# Altium project BugBuster_DAQ.PrjPcb (part 3 of 3)
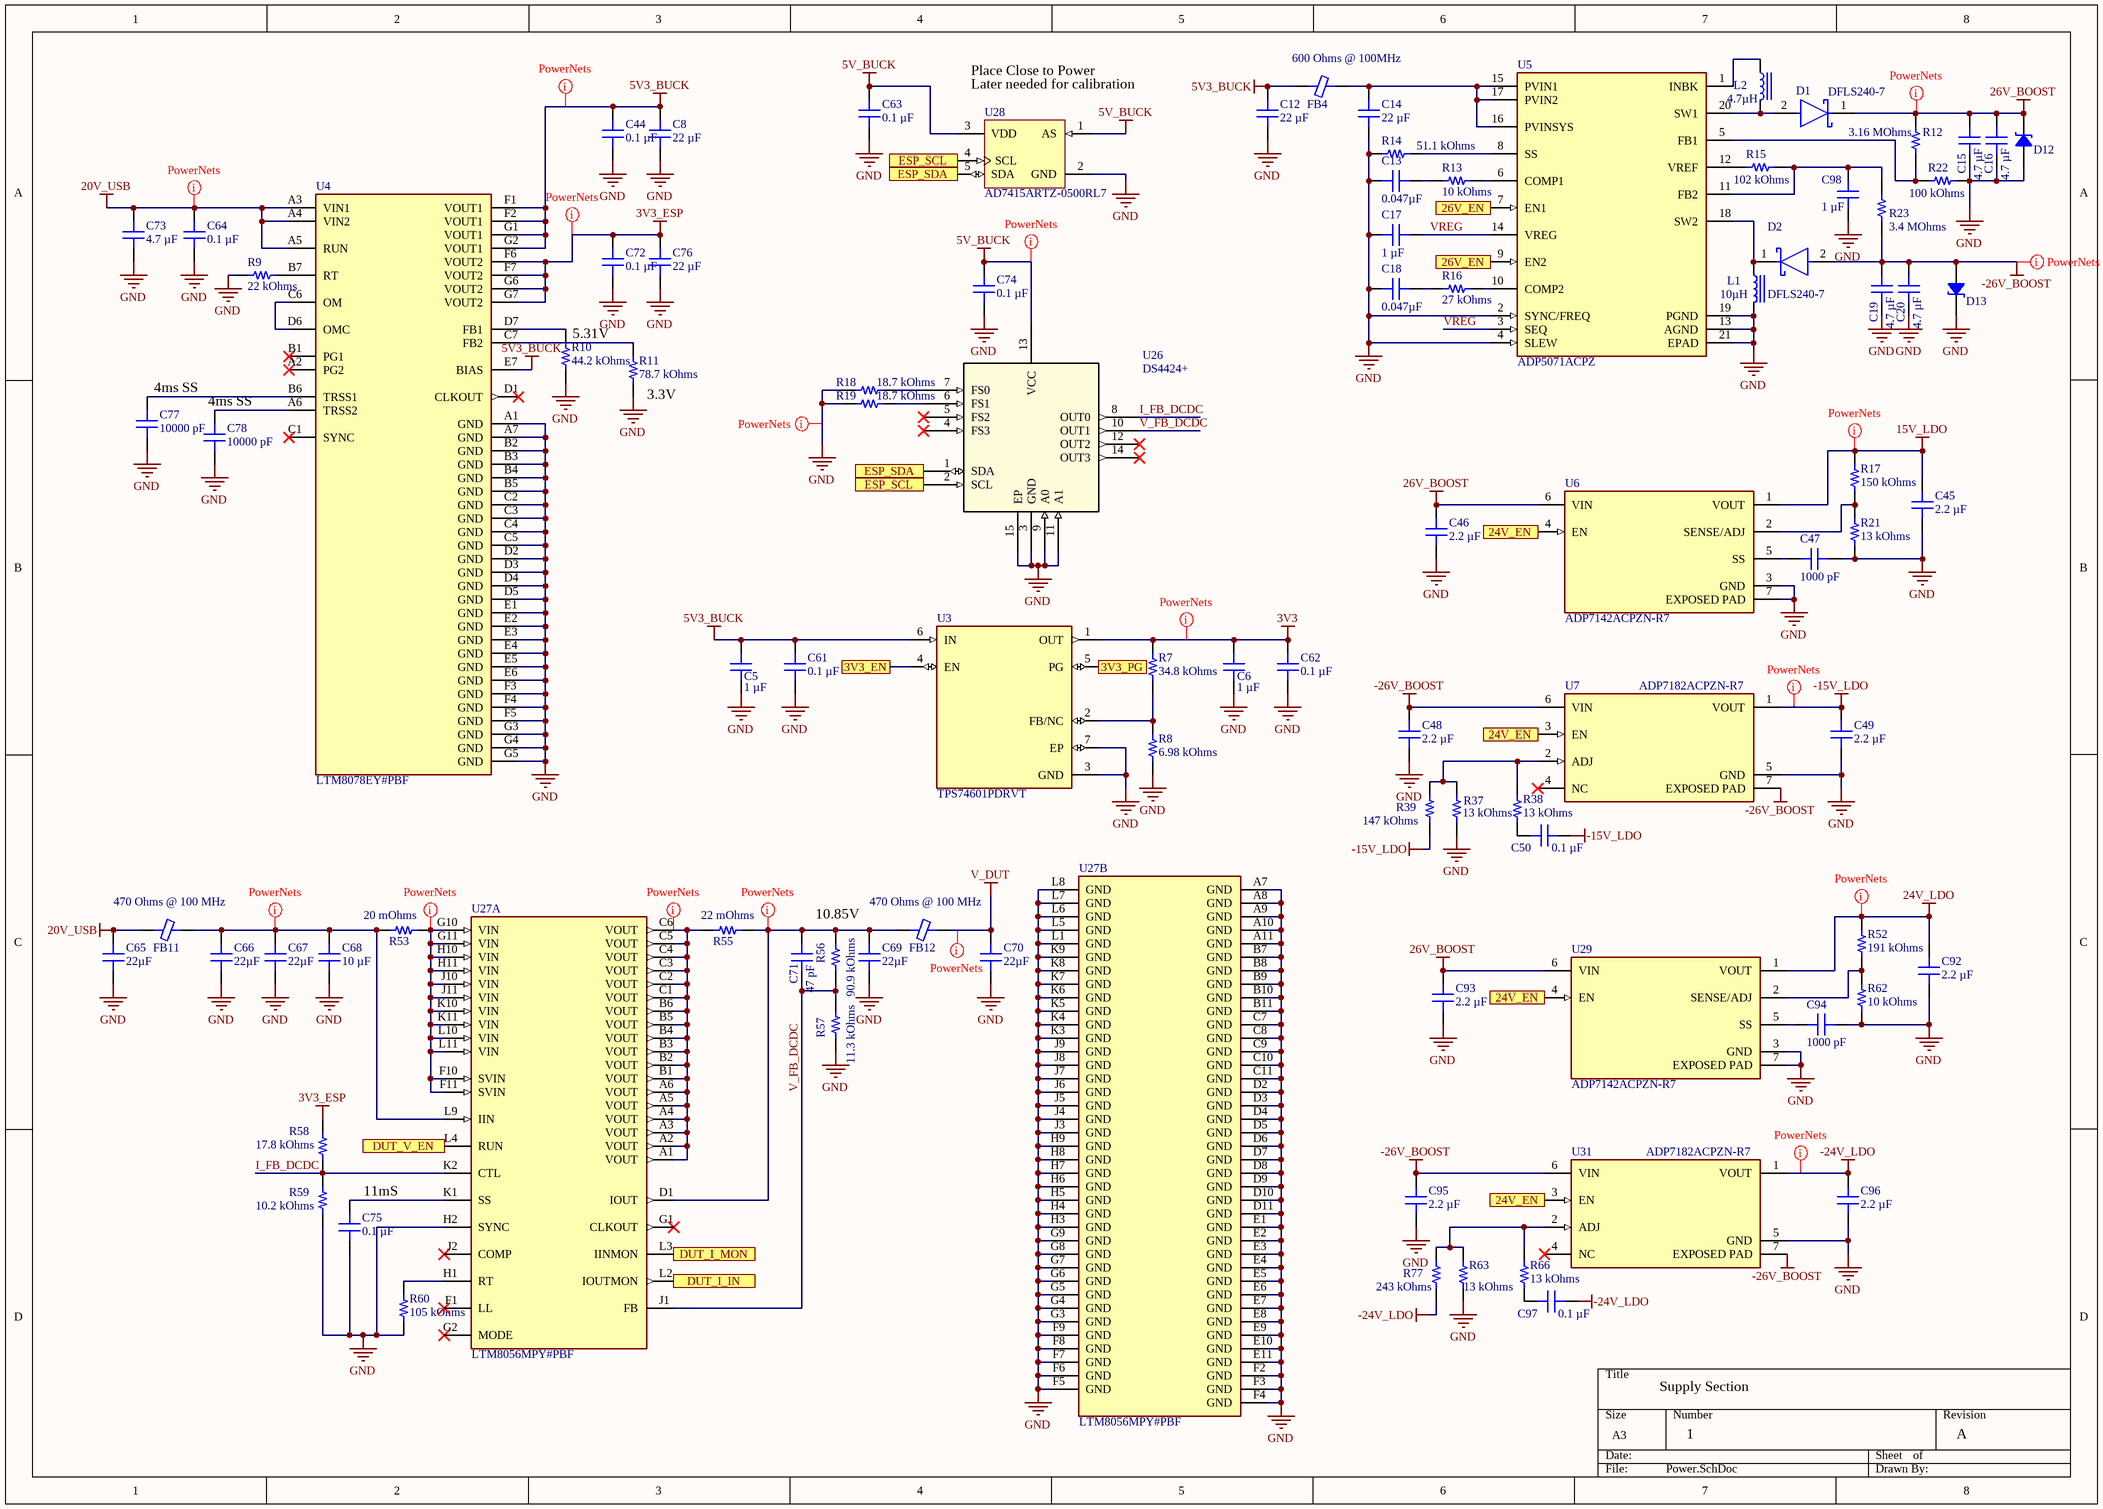
[diagram p7: Power.SchDoc]

## Sheet Power.SchDoc (continued)

### Library data of the parts (continued)
U28 = AD7415ARTZ-0500RL7: +/-0.5 degrees C Accurate, 10-Bit Digital Temperature Sensor, 2.7 to 5.5 V Supply, Industrial, 5-pin SOT23 (RJ-5), Reel; Manufacturer: Analog Devices; Code_JEDEC: MO-178-AA; ComponentLink3URL: http://www.analog.com/static/imported-files/packages/PKG_PDF/SOT-23(RJ)/RJ_5.pdf; ComponentLink3Description: Package Specification; PartNumber: AD7415ARTZ-0500RL7; PackageDescription: 5-Pin Small Outline Transistor Package, Body 2.9 x 1.6 mm, Pitch 0.95 mm; Supply Voltage Range: 2.7 to 5.5 V; Packing: Reel; DatasheetVersion: Rev. F; Mounting Technology: Surface Mount; PackageVersion: 121608-A , 12/2008; ComponentLink1URL: http://www.analog.com/en/index.html; PackageReference: RJ-5; ComponentLink4Description: Product URL; ComponentLink4URL: http://www.analog.com/en/mems-sensors/digital-temperature-sensors/ad7415/products/product.html; ComponentLink2Description: Datasheet; ComponentLink2URL: http://www.analog.com/static/imported-files/data_sheets/AD7414_7415.pdf; ComponentLink1Description: Manufacturer URL

## Sheet IOs.SchDoc
size A4; SheetNumber: 3; SheetTotal: 5
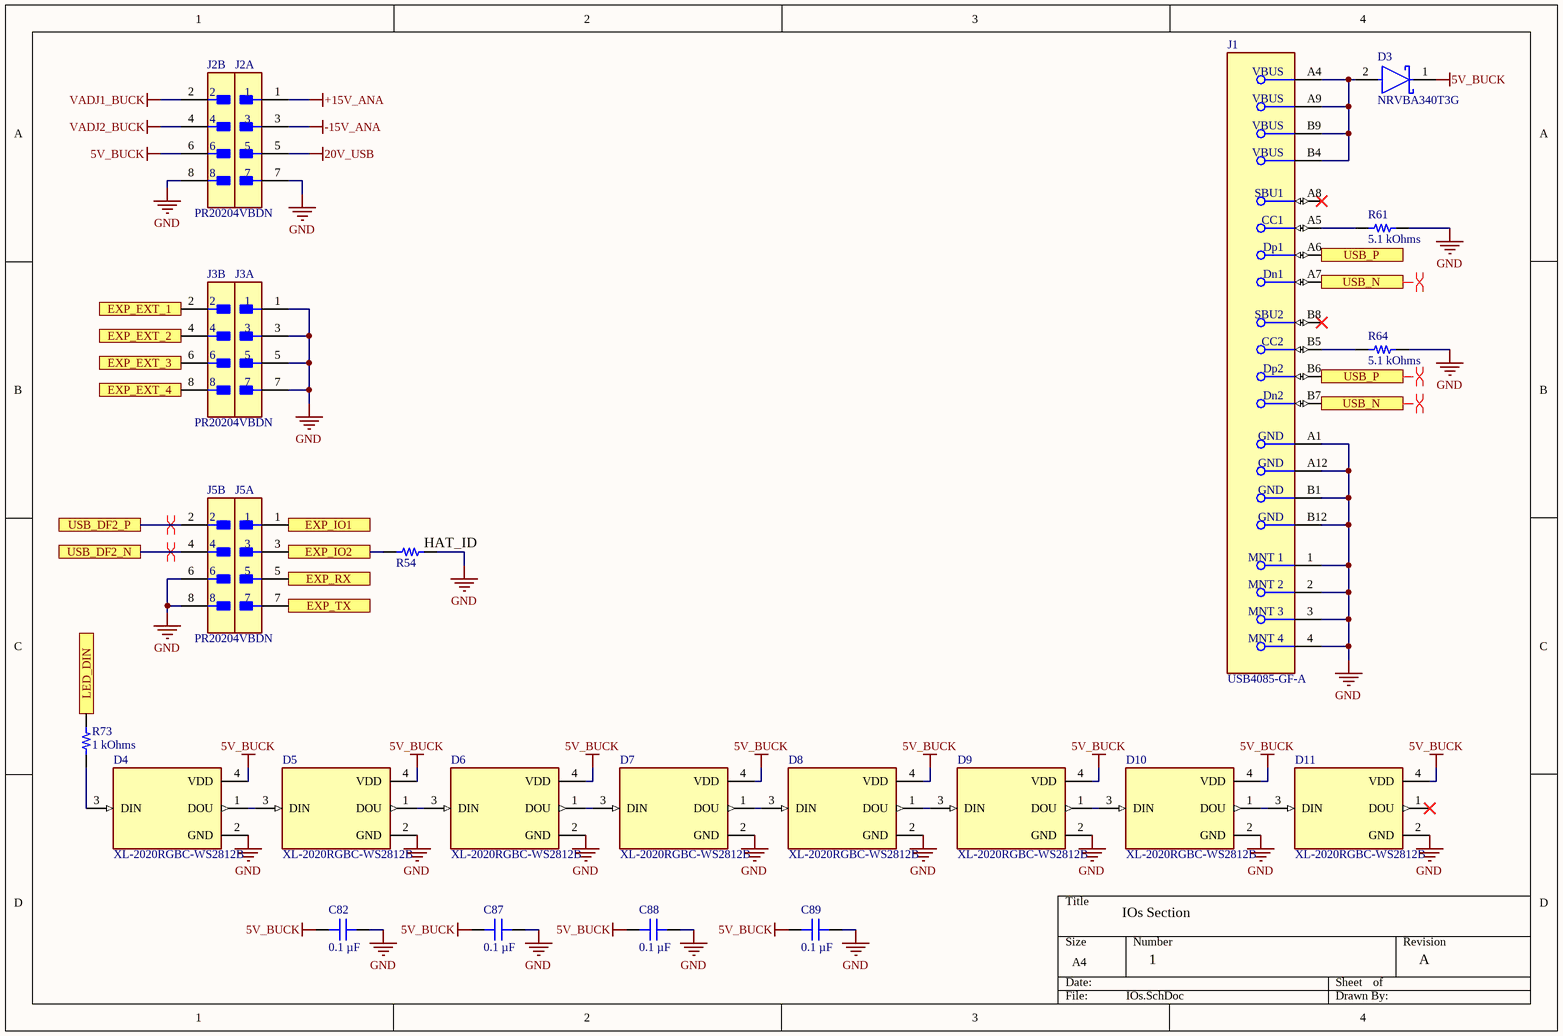
[diagram p3: IOs.SchDoc]

### Parts
C82  0.1 µF  [CAP 0603_1608]
C87  0.1 µF  [CAP 0603_1608]
C88  0.1 µF  [CAP 0603_1608]
C89  0.1 µF  [CAP 0603_1608]
D3  NRVBA340T3G  [FP-403D-MFG]
D4  XL-2020RGBC-WS2812B  [LED_XL-2020RGBC-WS2812B]
D5  XL-2020RGBC-WS2812B  [LED_XL-2020RGBC-WS2812B]
D6  XL-2020RGBC-WS2812B  [LED_XL-2020RGBC-WS2812B]
D7  XL-2020RGBC-WS2812B  [LED_XL-2020RGBC-WS2812B]
D8  XL-2020RGBC-WS2812B  [LED_XL-2020RGBC-WS2812B]
D9  XL-2020RGBC-WS2812B  [LED_XL-2020RGBC-WS2812B]
D10  XL-2020RGBC-WS2812B  [LED_XL-2020RGBC-WS2812B]
D11  XL-2020RGBC-WS2812B  [LED_XL-2020RGBC-WS2812B]
J1  USB4085-GF-A  [FP-USB4085-GF-A-MFG]
J2  PR20204VBDN  [FP-PR20204VBDN-MFG]  (parts A,B of 2)
J3  PR20204VBDN  [FP-PR20204VBDN-MFG]  (parts A,B of 2)
J5  PR20204VBDN  [FP-PR20204VBDN-MFG]  (parts A,B of 2)
R54  0 Ohms  [RES 0603_1608]  (value not drawn)
R61  5.1 kOhms  [RES 0603_1608]
R64  5.1 kOhms  [RES 0603_1608]
R73  1 kOhms  [RES 0603_1608]

### Ports
EXP_EXT_1, EXP_EXT_2, EXP_EXT_3, EXP_EXT_4, EXP_IO1, EXP_IO2, EXP_RX, EXP_TX, LED_DIN, USB_DF2_N, USB_DF2_P, USB_N, USB_P

### Nets
5V_BUCK: C82.2 C87.2 C88.2 C89.2 D3.1(C) D4.4(VDD) D5.4(VDD) D6.4(VDD) D7.4(VDD) D8.4(VDD) D9.4(VDD) D10.4(VDD) D11.4(VDD) J2.6
20V_USB: J2.5
+15V_ANA: J2.1
-15V_ANA: J2.3
GND: C82.1 C87.1 C88.1 C89.1 D4.2(GND) D5.2(GND) D6.2(GND) D7.2(GND) D8.2(GND) D9.2(GND) D10.2(GND) D11.2(GND) J1.1(MNT_1) J1.2(MNT_2) J1.3(MNT_3) J1.4(MNT_4) J1.A1(GND) J1.A12(GND) J1.B1(GND) J1.B12(GND) J2.7 J2.8 J3.1 J3.3 J3.5 J3.7 J5.6 J5.8 R54.1 R61.2 R64.2
VADJ1_BUCK: J2.2
VADJ2_BUCK: J2.4
USB_FS_N: J1.A7(Dn1) J1.B7(Dn2) ; port USB_N
USB_FS_P: J1.A6(Dp1) J1.B6(Dp2) ; port USB_P
USB_HS_N: J5.4 ; port USB_DF2_N
USB_HS_P: J5.2 ; port USB_DF2_P
NetD3_2: D3.2(A) J1.A4(VBUS) J1.A9(VBUS) J1.B4(VBUS) J1.B9(VBUS)
NetD4_1: D4.1(DOU) D5.3(DIN)
NetD4_3: D4.3(DIN) R73.1
NetD5_1: D5.1(DOU) D6.3(DIN)
NetD6_1: D6.1(DOU) D7.3(DIN)
NetD7_1: D7.1(DOU) D8.3(DIN)
NetD8_1: D8.1(DOU) D9.3(DIN)
NetD9_1: D9.1(DOU) D10.3(DIN)
NetD10_1: D10.1(DOU) D11.3(DIN)
NetJ1_A5: J1.A5(CC1) R61.1
NetJ1_B5: J1.B5(CC2) R64.1
NetJ3_2: J3.2 ; port EXP_EXT_1
NetJ3_4: J3.4 ; port EXP_EXT_2
NetJ3_6: J3.6 ; port EXP_EXT_3
NetJ3_8: J3.8 ; port EXP_EXT_4
NetJ5_1: J5.1 ; port EXP_IO1
NetJ5_3: J5.3 R54.2 ; port EXP_IO2
NetJ5_5: J5.5 ; port EXP_RX
NetJ5_7: J5.7 ; port EXP_TX
NetR73_2: R73.2 ; port LED_DIN

Not connected (* = marked no-connect by the designer): D11 1(DOU)*; J1 A8(SBU1)* B8(SBU2)*

### Layout directives
differential pair; differential pair class USB: USB_FS_N, USB_FS_P, USB_HS_N, USB_HS_P

### Notes on the sheet
- (near R54) HAT_ID
- IOs Section
- 1
- A

### Library data of the parts
C82 C87-C89 = C0603C104M5RACTU: SMT Capacitor; manufacturer: KEMET; Temperature Coefficient: X7R; Tolerance: ±20%; Voltage - Rated: 50V; Part Number: C0603C104M5RACTU; value: 0.1 µF; Applications: Bypass, Decoupling; Capacitance: 0.1 µF; componentlink1description: Datasheet; componentlink1url: https://api.kemet.com/component-edge/download/datasheet/C0603C104M5RACTU.pdf; componentlink2description: DigiKey Link; componentlink2url: https://www.digikey.com/en/products/detail/kemet/C0603C104M5RACTU/2199782; Device Package: 0603 (1608 Metric); lastupdated: 06/04/2026 19:22:47; Lifecycle Status: Active; Minimum Order: 1; Mounting Type: Surface Mount, MLCC; Operating Temperature: -55°C ~ 125°C; Package / Case: 0603 (1608 Metric); packaging: CutTape; partid: 69106; Part Status: Active; price: 0.01; series: SMD Comm X7R; Size / Dimension: 0.063" L x 0.031" W (1.60mm x 0.80mm); Supplier 1: DigiKey; Supplier Part Number 1: 399-C0603C104M5RACTUCT-ND; Thickness (Max): 0.034" (0.87mm)
D3 = CMP-1055-00307-2: DIODE SCHOTTKY 40V 3A SMA; Peak Non-Repetitive Surge Current: 100A; Max Reverse Current: 15mA; Forward Voltage: 450mV; Element Configuration: Single; Radiation Hardening: No; Max Operating Temperature: 150°C; Min Operating Temperature: -55°C; Package Quantity: 5000; Lead Free: Lead Free; Average Rectified Current: 3A; REACH SVHC: No SVHC; RoHS Compliant: Yes; Number of Pins: 2; Length: 4.57mm; Halogen Free: Halogen Free; Packaging: Tape and Reel; Height: 2.05mm; Max Repetitive Reverse Voltage (Vrrm): 40V; Series: -; Case/Package: SMA; Max Reverse Voltage (DC): 40V; Width: 2.92mm; Max Forward Surge Current (Ifsm): 100A; Forward Current: 3A; Weight: 0.003739oz
D4-D11 = XL-2020RGBC-WS2812B: 2020 RGB LED(BUILT-IN IC); MF: XINGLIGHT; SnapEDA_Link: https://www.snapeda.com/parts/XL-2020RGBC-WS2812B/Xinglight/view-part/?ref=snap; Package: None; Value: *; MP: XL-2020RGBC-WS2812B; Check_prices: https://www.snapeda.com/parts/XL-2020RGBC-WS2812B/Xinglight/view-part/?ref=eda
J1 = CMP-196119-000001-2: CONN RCPT USB2.0 TYPE C 24POS RA; Gender: Receptacle; Number of Positions: 16; USB Standard: USB 2.0; Orientation: Right Angle; Contact Plating: Gold; Contact Material: Copper Alloy
J2 J3 J5 = CMP-77940-000004-1: PIN HEADER, THR, DUAL ROW, .100"
R54 = WSL060300000ZEA9: RES 0 OHM JUMPER 0603; Manufacturer: Vishay Dale; Temperature Coefficient: ±3900ppm/°C; Part Number: WSL060300000ZEA9; ComponentLink1Description: Datasheet; ComponentLink1URL: http://www.vishay.com/docs/30192/wsl-9.pdf; ComponentLink2Description: DigiKey Link; ComponentLink2URL: https://www.digikey.com/en/products/detail/vishay-dale/WSL060300000ZEA9/7423217; Composition: Metal Element; Device Package: 0603 (1608 Metric); Height - Seated (Max): 0.021" (0.53mm); LastUpdated: 09/02/2024 20:43:09; Lifecycle Status: Active; Minimum Order: 1; Number of Terminations: 2; Operating Temperature: -65°C ~ 170°C; Package / Case: 0603 (1608 Metric); Packaging: TapeAndReel; PartId: 11865; Part Status: Active; Price: 0.39; Resistance: 0 Ohms; Series: WSL; Size / Dimension: 0.060" L x 0.030" W (1.52mm x 0.76mm); Supplier 1: DigiKey; Supplier Part Number 1: 541-3927-1-ND; Supplier Device Package: 0603; Tolerance: Jumper; Value: 0 Ohms
R61 R64 = ERJ-PA3F5101V: RES SMD 5.1K OHM 1% 1/3W 0603; Manufacturer: Panasonic Electronic Components; Power (Watts): 0.333W 1/3W; Temperature Coefficient: ±100ppm/°C; ComponentLink1Description: Datasheet; ComponentLink1URL: https://industrial.panasonic.com/cdbs/www-data/pdf/RDO0000/AOA0000C331.pdf; ComponentLink2Description: DigiKey Link; ComponentLink2URL: https://www.digikey.com/en/products/detail/panasonic-electronic-components/ERJ-PA3F5101V/5035934; Composition: Thick Film; Device Package: 0603 (1608 Metric); Features: Automotive AEC-Q200 Pulse Withstanding; Height - Seated (Max): 0.022\ (0.55mm); LastUpdated: 2024-02-09 20:42:57.823000; Lifecycle Status: Active; Part Number: ERJ-PA3F5101V; Minimum Order: 1; Number of Terminations: 2; Operating Temperature: -55°C ~ 155°C; Package / Case: 0603 (1608 Metric); Packaging: TapeAndReel; PartId: 14704; Part Status: Active; Price: 0.01; Ratings: AEC-Q200; Resistance: 5.1 kOhms; Series: ERJ-PA3; Size / Dimension: 0.063\ L x 0.031\ W (1.60mm x 0.80mm); Supplier 1: DigiKey; Supplier Part Number 1: P5.1KBYCT-ND; Supplier Device Package: 0603; Tolerance: ±1%; Value: 5.1 kOhms
R73 = ERJ-PA3F1001V: RES SMD 1K OHM 1% 1/3W 0603; Manufacturer: Panasonic Electronic Components; Power (Watts): 0.333W 1/3W; Temperature Coefficient: ±100ppm/°C; ComponentLink1Description: Datasheet; ComponentLink1URL: https://industrial.panasonic.com/cdbs/www-data/pdf/RDO0000/AOA0000C331.pdf; ComponentLink2Description: DigiKey Link; ComponentLink2URL: https://www.digikey.com/en/products/detail/panasonic-electronic-components/ERJ-PA3F1001V/5035848; Composition: Thick Film; Device Package: 0603 (1608 Metric); Features: Automotive AEC-Q200 Pulse Withstanding; Height - Seated (Max): 0.022\ (0.55mm); LastUpdated: 2024-02-09 20:42:57.220000; Lifecycle Status: Active; Part Number: ERJ-PA3F1001V; Minimum Order: 1; Number of Terminations: 2; Operating Temperature: -55°C ~ 155°C; Package / Case: 0603 (1608 Metric); Packaging: TapeAndReel; PartId: 14885; Part Status: Active; Price: 0.01; Ratings: AEC-Q200; Resistance: 1 kOhms; Series: ERJ-PA3; Size / Dimension: 0.063\ L x 0.031\ W (1.60mm x 0.80mm); Supplier 1: DigiKey; Supplier Part Number 1: P1.0KBYCT-ND; Supplier Device Package: 0603; Tolerance: ±1%; Value: 1 kOhms

## Sheet ESP32P4.SchDoc
size A4; SheetNumber: 4; SheetTotal: 5
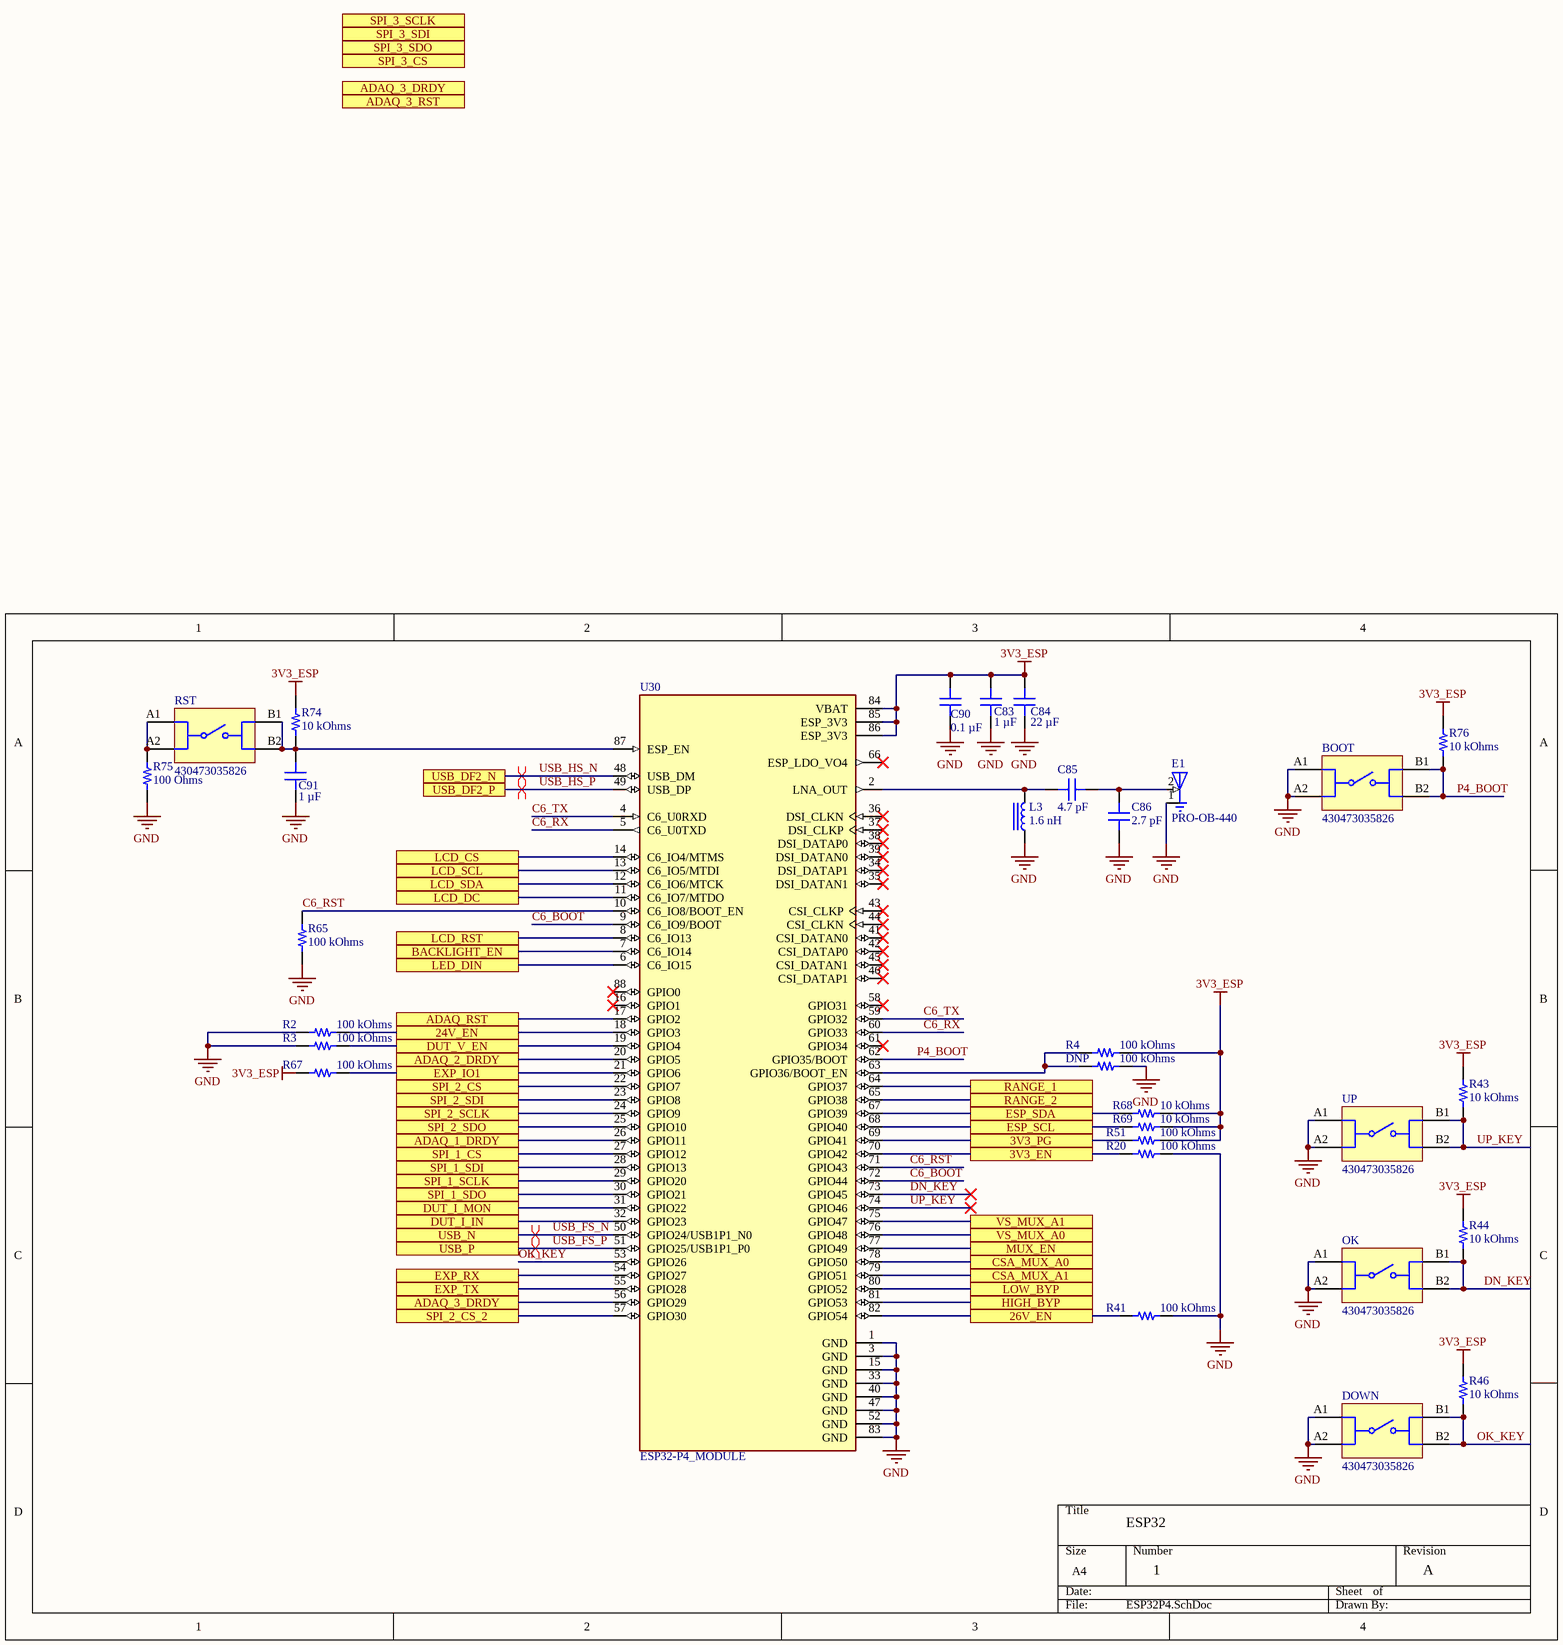
[diagram p4: ESP32P4.SchDoc]

### Parts
BOOT  430473035826  [430473035826]
C83  1 µF  [CAP 0603_1608]
C84  22 µF  [CAP 0603_1608]
C85  4.7 pF  [CAP 0603_1608]
C86  2.7 pF  [CAP 0603_1608]
C90  0.1 µF  [CAP 0603_1608]
C91  1 µF  [CAP 0603_1608]
DNP  100 kOhms  [RES 0603_1608]
DOWN  430473035826  [430473035826]
E1  PRO-OB-440  [XDCR_PRO-OB-440]
L3  1.6 nH  [Murata LQW18 0603]
OK  430473035826  [430473035826]
R2  100 kOhms  [RES 0603_1608]
R3  100 kOhms  [RES 0603_1608]
R4  100 kOhms  [RES 0603_1608]
R20  100 kOhms  [RES 0603_1608]
R41  100 kOhms  [RES 0603_1608]
R43  10 kOhms  [RES 0603_1608]
R44  10 kOhms  [RES 0603_1608]
R46  10 kOhms  [RES 0603_1608]
R51  100 kOhms  [RES 0603_1608]
R65  100 kOhms  [RES 0603_1608]
R67  100 kOhms  [RES 0603_1608]
R68  10 kOhms  [RES 0603_1608]
R69  10 kOhms  [RES 0603_1608]
R74  10 kOhms  [RES 0603_1608]
R75  100 Ohms  [RES 0603_1608]
R76  10 kOhms  [RES 0603_1608]
RST  430473035826  [430473035826]
U30  ESP32-P4_MODULE  [XCVR_ESP32-P4_MODULE]
UP  430473035826  [430473035826]

### Ports
3V3_EN, 3V3_PG, 24V_EN, 26V_EN, ADAQ_1_DRDY, ADAQ_2_DRDY, ADAQ_3_DRDY, ADAQ_3_RST, ADAQ_RST, BACKLIGHT_EN, CSA_MUX_A0, CSA_MUX_A1, DUT_I_IN, DUT_I_MON, DUT_V_EN, ESP_SCL, ESP_SDA, EXP_IO1, EXP_RX, EXP_TX, HIGH_BYP, LCD_CS, LCD_DC, LCD_RST, LCD_SCL, LCD_SDA, LED_DIN, LOW_BYP, MUX_EN, RANGE_1, RANGE_2, SPI_1_CS, SPI_1_SCLK, SPI_1_SDI, SPI_1_SDO, SPI_2_CS, SPI_2_CS_2, SPI_2_SCLK, SPI_2_SDI, SPI_2_SDO, SPI_3_CS, SPI_3_SCLK, SPI_3_SDI, SPI_3_SDO, USB_DF2_N, USB_DF2_P, USB_N, USB_P, VS_MUX_A0, VS_MUX_A1

### Nets
3V3_ESP: C83.2 C84.2 C90.2 R4.2 R43.2 R44.2 R46.2 R51.2 R67.1 R68.2 R69.2 R74.2 R76.2 U30.84(VBAT) U30.85(ESP_3V3) U30.86(ESP_3V3)
GND: BOOT.A1 BOOT.A2 C83.1 C84.1 C86.1 C90.1 C91.1 DNP.2 DOWN.A1 DOWN.A2 E1.1(GND) L3.1 OK.A1 OK.A2 R2.1 R3.1 R20.2 R41.2 R65.2 R75.1 U30.1(GND) U30.3(GND) U30.15(GND) U30.33(GND) U30.40(GND) U30.47(GND) U30.52(GND) U30.83(GND) UP.A1 UP.A2
C6_BOOT: U30.9(C6_IO9/BOOT) U30.72(GPIO44)
C6_RST: R65.1 U30.10(C6_IO8/BOOT_EN) U30.71(GPIO43)
C6_RX: U30.5(C6_U0TXD) U30.60(GPIO33)
C6_TX: U30.4(C6_U0RXD) U30.59(GPIO32)
DN_KEY: OK.B1 OK.B2 R44.1 U30.73(GPIO45)
OK_KEY: DOWN.B1 DOWN.B2 R46.1 U30.53(GPIO26)
P4_BOOT: BOOT.B1 BOOT.B2 R76.1 U30.62(GPIO35/BOOT)
UP_KEY: R43.1 U30.74(GPIO46) UP.B1 UP.B2
USB_FS_N: U30.50(GPIO24/USB1P1_N0) ; port USB_N
USB_FS_P: U30.51(GPIO25/USB1P1_P0) ; port USB_P
USB_HS_N: U30.48(USB_DM) ; port USB_DF2_N
USB_HS_P: U30.49(USB_DP) ; port USB_DF2_P
NetC85_1: C85.1 C86.2 E1.2(FEED)
NetC85_2: C85.2 L3.2 U30.2(LNA_OUT)
NetC91_2: C91.2 R74.1 RST.B1 RST.B2 U30.87(ESP_EN)
NetDNP_1: DNP.1 R4.1 U30.63(GPIO36/BOOT_EN)
NetJ4_1: U30.14(C6_IO4/MTMS) ; port LCD_CS
NetJ4_3: U30.13(C6_IO5/MTDI) ; port LCD_SCL
NetJ4_4: U30.12(C6_IO6/MTCK) ; port LCD_SDA
NetJ4_5: U30.11(C6_IO7/MTDO) ; port LCD_DC
NetJ4_6: U30.8(C6_IO13) ; port LCD_RST
NetJ5_1: R67.2 U30.21(GPIO6) ; port EXP_IO1
NetJ5_5: U30.54(GPIO27) ; port EXP_RX
NetJ5_7: U30.55(GPIO28) ; port EXP_TX
NetR2_2: R2.2 U30.18(GPIO3) ; port 24V_EN
NetR3_2: R3.2 U30.19(GPIO4) ; port DUT_V_EN
NetR5_2: U30.64(GPIO37) ; port RANGE_1
NetR6_2: U30.65(GPIO38) ; port RANGE_2
NetR20_1: R20.1 U30.70(GPIO42) ; port 3V3_EN
NetR25_2: U30.80(GPIO52) ; port LOW_BYP
NetR28_2: U30.81(GPIO53) ; port HIGH_BYP
NetR41_1: R41.1 U30.82(GPIO54) ; port 26V_EN
NetR42_2: U30.7(C6_IO14) ; port BACKLIGHT_EN
NetR51_1: R51.1 U30.69(GPIO41) ; port 3V3_PG
NetR68_1: R68.1 U30.67(GPIO39) ; port ESP_SDA
NetR69_1: R69.1 U30.68(GPIO40) ; port ESP_SCL
NetR73_2: U30.6(C6_IO15) ; port LED_DIN
NetR75_2: R75.2 RST.A1 RST.A2
NetU1_C9: U30.17(GPIO2) ; port ADAQ_RST
NetU1_E10: U30.30(GPIO21) ; port SPI_1_SDO
NetU1_E11: U30.29(GPIO20) ; port SPI_1_SCLK
NetU1_E12: U30.28(GPIO13) ; port SPI_1_SDI
NetU1_E13: U30.27(GPIO12) ; port SPI_1_CS
NetU1_E14: U30.26(GPIO11) ; port ADAQ_1_DRDY
NetU22_E10: U30.25(GPIO10) ; port SPI_2_SDO
NetU22_E11: U30.24(GPIO9) ; port SPI_2_SCLK
NetU22_E12: U30.23(GPIO8) ; port SPI_2_SDI
NetU22_E13: U30.22(GPIO7) ; port SPI_2_CS
NetU22_E14: U30.20(GPIO5) ; port ADAQ_2_DRDY
NetU23_E13: U30.57(GPIO30) ; port SPI_2_CS_2
NetU23_E14: U30.56(GPIO29) ; port ADAQ_3_DRDY
NetU24_14: U30.79(GPIO51) ; port CSA_MUX_A1
NetU24_15: U30.78(GPIO50) ; port CSA_MUX_A0
NetU24_16: U30.77(GPIO49) ; port MUX_EN
NetU25_14: U30.75(GPIO47) ; port VS_MUX_A1
NetU25_15: U30.76(GPIO48) ; port VS_MUX_A0
NetU27_L2: U30.32(GPIO23) ; port DUT_I_IN
NetU27_L3: U30.31(GPIO22) ; port DUT_I_MON

Not connected (* = marked no-connect by the designer): U30 16(GPIO1)* 34(DSI_DATAP1)* 35(DSI_DATAN1)* 36(DSI_CLKN)* 37(DSI_CLKP)* 38(DSI_DATAP0)* 39(DSI_DATAN0)* 41(CSI_DATAN0)* 42(CSI_DATAP0)* 43(CSI_CLKP)* 44(CSI_CLKN)* 45(CSI_DATAN1)* 46(CSI_DATAP1)* 58(GPIO31)* 61(GPIO34)* 66(ESP_LDO_VO4)* 88(GPIO0)*

### Layout directives
differential pair; differential pair class USB: USB_FS_N, USB_FS_P, USB_HS_N, USB_HS_P

### Notes on the sheet
- ESP32
- 1
- A

### Library data of the parts
BOOT DOWN OK RST UP = CMP-1455-00006-5: Switch Tactile Spst-no 0.05A 12V; Actuator Material: Liquid Crystal Polymer, Polymer; Switch Travel: 250µm; Throw Configuration: SPST; Illumination Type: Non-Illuminated; Insulation Resistance: 100MΩ; Current Rating: 50mA; Switch Function: Off-Mom; Mechanical Life: 500kcycles; Min Operating Temperature: -40°C; Packaging: Tape and Reel; Max Operating Temperature: 85°C; Mount: Surface Mount; Contact Plating: Silver; RoHS: Compliant; Voltage Rating: 12V; Height: 3.5mm
C83 C91 = GMC10X7R105M50NT: SMT Capacitor; manufacturer: Cal-Chip Electronics, Inc.; Temperature Coefficient: X7R; Tolerance: ±20%; Voltage - Rated: 50V; Part Number: GMC10X7R105M50NT; Applications: General Purpose; Capacitance: 1 µF; componentlink1description: Datasheet; componentlink1url: https://calchip.com/wp-content/uploads/2024/02/gmc_series-1.pdf; componentlink2description: DigiKey Link; componentlink2url: https://www.digikey.com/en/products/detail/cal-chip-electronics-inc/GMC10X7R105M50NT/25323876; Device Package: 0603 (1608 Metric); lastupdated: 06/04/2026 19:17:52; Lifecycle Status: Active; Minimum Order: 1; Mounting Type: Surface Mount, MLCC; Operating Temperature: -55°C ~ 125°C; Package / Case: 0603 (1608 Metric); packaging: TapeAndReel; partid: 65934; price: 0.06; series: GMC; Size / Dimension: 0.063" L x 0.031" W (1.60mm x 0.80mm); Supplier 1: DigiKey; Supplier Part Number 1: 4713-GMC10X7R105M50NTCT-ND; Thickness (Max): 0.037" (0.95mm); value: 1 µF
C84 = GRM188C61C226ME01D: SMT Capacitor; manufacturer: Murata Electronics; Temperature Coefficient: X5S; Tolerance: ±20%; Voltage - Rated: 16V; Part Number: GRM188C61C226ME01D; value: 22 µF; Applications: General Purpose; Capacitance: 22 µF; componentlink1description: Datasheet; componentlink1url: https://search.murata.co.jp/Ceramy/image/img/A01X/G101/ENG/GRM188C61C226ME01-01A.pdf; componentlink2description: DigiKey Link; componentlink2url: https://www.digikey.com/en/products/detail/murata-electronics/GRM188C61C226ME01D/22528395; Device Package: 0603 (1608 Metric); lastupdated: 06/04/2026 19:18:15; Lifecycle Status: Active; Minimum Order: 1; Mounting Type: Surface Mount, MLCC; Operating Temperature: -55°C ~ 85°C; Package / Case: 0603 (1608 Metric); packaging: TapeAndReel; partid: 60294; price: 0.08; series: GRM; Size / Dimension: 0.063" L x 0.031" W (1.60mm x 0.80mm); Supplier 1: DigiKey; Supplier Part Number 1: 490-GRM188C61C226ME01DCT-ND; Thickness (Max): 0.039" (1.00mm)
C85 = 06035C4R7KAT2A: SMT Capacitor; manufacturer: KYOCERA AVX; Temperature Coefficient: X7R; Tolerance: ±10%; Voltage - Rated: 50V; Part Number: 06035C4R7KAT2A; value: 4.7 pF; Applications: General Purpose; Capacitance: 4.7 pF; componentlink2description: DigiKey Link; componentlink2url: https://www.digikey.com/en/products/detail/kyocera-avx/06035C4R7KAT2A/11259106; Device Package: 0603 (1608 Metric); lastupdated: 06/04/2026 19:18:45; Lifecycle Status: Active; Minimum Order: 1; Mounting Type: Surface Mount, MLCC; Operating Temperature: -55°C ~ 125°C; Package / Case: 0603 (1608 Metric); packaging: TapeAndReel; partid: 68839; price: 0.03; series: -; Size / Dimension: 0.063" L x 0.032" W (1.60mm x 0.81mm); Supplier 1: DigiKey; Supplier Part Number 1: 478-06035C4R7KAT2ACT-ND; Thickness (Max): 0.035" (0.90mm)
C86 = C0603C279D5GAC7867: SMT Capacitor; manufacturer: KEMET; Temperature Coefficient: C0G, NP0; Tolerance: ±0.5pF; Voltage - Rated: 50V; Part Number: C0603C279D5GAC7867; value: 2.7 pF; Applications: General Purpose; Capacitance: 2.7 pF; componentlink1description: Datasheet; componentlink1url: https://api.kemet.com/component-edge/download/datasheet/C0603C279D5GACTU.pdf; componentlink2description: DigiKey Link; componentlink2url: https://www.digikey.com/en/products/detail/kemet/C0603C279D5GAC7867/2200451; Device Package: 0603 (1608 Metric); Features: Low ESL; lastupdated: 06/04/2026 19:22:23; Lifecycle Status: Active; Minimum Order: 1; Mounting Type: Surface Mount, MLCC; Operating Temperature: -55°C ~ 125°C; Package / Case: 0603 (1608 Metric); packaging: TapeAndReel; partid: 34968; Part Status: Active; price: 0.04; series: SMD Comm C0G; Size / Dimension: 0.063" L x 0.031" W (1.60mm x 0.80mm); Supplier 1: DigiKey; Supplier Part Number 1: 399-C0603C279D5GAC7867CT-ND; Thickness (Max): 0.034" (0.87mm)
C90 = C0603C104M5RACTU: as C82 on sheet IOs; Part Number: C0603C104M5RACTU; value: 0.1 µF; Applications: Bypass, Decoupling; Capacitance: 0.1 µF; componentlink1description: Datasheet; componentlink1url: https://api.kemet.com/component-edge/download/datasheet/C0603C104M5RACTU.pdf; componentlink2description: DigiKey Link; componentlink2url: https://www.digikey.com/en/products/detail/kemet/C0603C104M5RACTU/2199782; Device Package: 0603 (1608 Metric); lastupdated: 06/04/2026 19:22:47; Lifecycle Status: Active; Minimum Order: 1; Mounting Type: Surface Mount, MLCC; Operating Temperature: -55°C ~ 125°C; Package / Case: 0603 (1608 Metric); packaging: CutTape; partid: 69106; Part Status: Active; price: 0.01; series: SMD Comm X7R; Size / Dimension: 0.063" L x 0.031" W (1.60mm x 0.80mm); Supplier 1: DigiKey; Supplier Part Number 1: 399-C0603C104M5RACTUCT-ND; Thickness (Max): 0.034" (0.87mm)
DNP R2-R4 R20 R41 R51 R65 R67 = ERJ-PA3F1003V: RES SMD 100K OHM 1% 1/3W 0603; Manufacturer: Panasonic Electronic Components; Power (Watts): 0.333W 1/3W; Temperature Coefficient: Â±100ppm/Â°C; Tolerance: Â±1%; ComponentLink1Description: Datasheet; ComponentLink1URL: https://industrial.panasonic.com/cdbs/www-data/pdf/RDO0000/AOA0000C331.pdf; ComponentLink2Description: DigiKey Link; ComponentLink2URL: https://www.digikey.com/en/products/detail/panasonic-electronic-components/ERJ-PA3F1003V/5035850; Composition: Thick Film; Device Package: 0603 (1608 Metric); Features: Automotive AEC-Q200 Pulse Withstanding; Height - Seated (Max): 0.022\ (0.55mm); LastUpdated: 2024-02-09 20:42:57.243000; Lifecycle Status: Active; Part Number: ERJ-PA3F1003V; Minimum Order: 1; Number of Terminations: 2; Operating Temperature: -55Â°C ~ 155Â°C; Package / Case: 0603 (1608 Metric); Packaging: TapeAndReel; PartId: 14879; Part Status: Active; Price: 0.01; Ratings: AEC-Q200; Resistance: 100 kOhms; Series: ERJ-PA3; Size / Dimension: 0.063\ L x 0.031\ W (1.60mm x 0.80mm); Supplier 1: DigiKey; Supplier Part Number 1: P100KBYCT-ND; Supplier Device Package: 0603; Value: 100 kOhms
E1 = PRO-OB-440: 2.4GHz Bluetooth, WirelessHART, WLAN, Zigbeeâ„¢ Stamped Metal RF Antenna 2.4GHz ~ 2.5GHz - Solder Surface Mount; MF: Abracon; SnapEDA_Link: https://www.snapeda.com/parts/PRO-OB-440/Abracon/view-part/?ref=snap; Package: None; Value: *; MP: PRO-OB-440; Check_prices: https://www.snapeda.com/parts/PRO-OB-440/Abracon/view-part/?ref=eda
L3 = LQW18AS1N6J0ZD: FIXED IND 1.6NH 700MA 30MOHM SMD; Manufacturer: Murata Electronics; DC Resistance (DCR): 30mOhm Max; Frequency - Self Resonant: 12.5GHz; Inductance Frequency - Test: 250 MHz; Material - Core: Non-Magnetic; Q @ Freq: 24 @ 250MHz; Shielding: Unshielded; Tolerance: ±5%; Type: Wirewound; Part Number: LQW18AS1N6J0ZD; ComponentLink1Description: Datasheet; ComponentLink1URL: https://search.murata.co.jp/Ceramy/image/img/P02/JELF243A-9139.pdf; ComponentLink2Description: DigiKey Link; ComponentLink2URL: https://www.digikey.com/en/products/detail/murata-electronics/LQW18AS1N6J0ZD/6799231; Current Rating (Amps): 700 mA; Device Package: 0603 (1608 Metric); Height - Seated (Max): 0.039" (1.00mm); Inductance: 1.6 nH; LastUpdated: 05/04/2026 21:06:49; Lifecycle Status: Active; Minimum Order: 1; Mounting Type: Surface Mount; Operating Temperature: -55°C ~ 125°C; Package / Case: 0603 (1608 Metric); Packaging: TapeAndReel; PartId: 873; Part Status: Active; Price: 0.05; Ratings: AEC-Q200; Series: LQW18; Size / Dimension: 0.063" L x 0.031" W (1.60mm x 0.80mm); Supplier 1: DigiKey; Supplier Part Number 1: 490-15806-1-ND; Supplier Device Package: 0603 (1608 Metric); Value: 1.6 nH
R43 R44 R46 R68 R69 R74 R76 = ERJ-PA3F1002V: RES SMD 10K OHM 1% 1/3W 0603; Manufacturer: Panasonic Electronic Components; Power (Watts): 0.333W 1/3W; Temperature Coefficient: Â±100ppm/Â°C; Tolerance: Â±1%; ComponentLink1Description: Datasheet; ComponentLink1URL: https://industrial.panasonic.com/cdbs/www-data/pdf/RDO0000/AOA0000C331.pdf; ComponentLink2Description: DigiKey Link; ComponentLink2URL: https://www.digikey.com/en/products/detail/panasonic-electronic-components/ERJ-PA3F1002V/5035849; Composition: Thick Film; Device Package: 0603 (1608 Metric); Features: Automotive AEC-Q200 Pulse Withstanding; Height - Seated (Max): 0.022\ (0.55mm); LastUpdated: 2024-02-09 20:42:57.847000; Lifecycle Status: Active; Part Number: ERJ-PA3F1002V; Minimum Order: 1; Number of Terminations: 2; Operating Temperature: -55Â°C ~ 155Â°C; Package / Case: 0603 (1608 Metric); Packaging: TapeAndReel; PartId: 14698; Part Status: Active; Price: 0.01; Ratings: AEC-Q200; Resistance: 10 kOhms; Series: ERJ-PA3; Size / Dimension: 0.063\ L x 0.031\ W (1.60mm x 0.80mm); Supplier 1: DigiKey; Supplier Part Number 1: P10KBYCT-ND; Supplier Device Package: 0603; Value: 10 kOhms
R75 = ERJ-PA3F1000V: RES SMD 100 OHM 1% 1/3W 0603; Manufacturer: Panasonic Electronic Components; Power (Watts): 0.333W 1/3W; Temperature Coefficient: ±100ppm/°C; ComponentLink1Description: Datasheet; ComponentLink1URL: https://industrial.panasonic.com/cdbs/www-data/pdf/RDO0000/AOA0000C331.pdf; ComponentLink2Description: DigiKey Link; ComponentLink2URL: https://www.digikey.com/en/products/detail/panasonic-electronic-components/ERJ-PA3F1000V/5035847; Composition: Thick Film; Device Package: 0603 (1608 Metric); Features: Automotive AEC-Q200 Pulse Withstanding; Height - Seated (Max): 0.022\ (0.55mm); LastUpdated: 2024-02-09 20:42:52.130000; Lifecycle Status: Active; Part Number: ERJ-PA3F1000V; Minimum Order: 1; Number of Terminations: 2; Operating Temperature: -55°C ~ 155°C; Package / Case: 0603 (1608 Metric); Packaging: TapeAndReel; PartId: 16197; Part Status: Active; Price: 0.01; Ratings: AEC-Q200; Resistance: 100 Ohms; Series: ERJ-PA3; Size / Dimension: 0.063\ L x 0.031\ W (1.60mm x 0.80mm); Supplier 1: DigiKey; Supplier Part Number 1: P100BYCT-ND; Supplier Device Package: 0603; Tolerance: ±1%; Value: 100 Ohms
U30 = ESP32-P4_MODULE: Dual-core RISC-V high-performance module; MF: Waveshare Electronics; MP: ESP32-P4 Module; SnapEDA_Link: https://www.snapeda.com/parts/ESP32-P4%20Module/Waveshare+Electronics/view-part/?ref=snap; Package: None; Value: *; Check_prices: https://www.snapeda.com/parts/ESP32-P4%20Module/Waveshare+Electronics/view-part/?ref=eda

## Sheet LCD.SchDoc
size A4; SheetNumber: 5; SheetTotal: 5
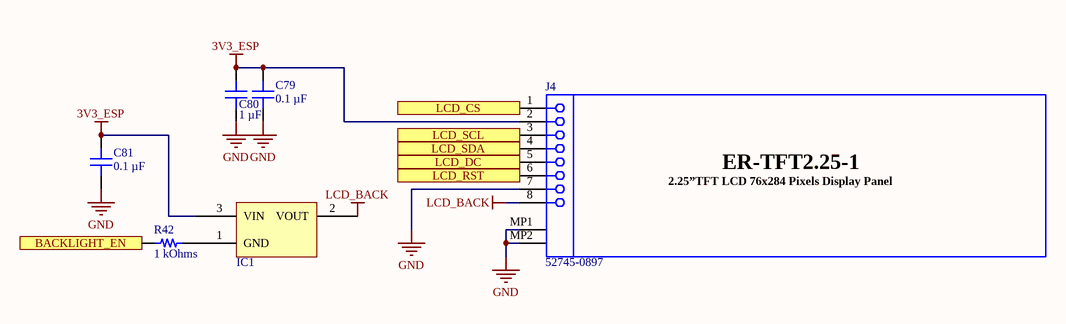
[diagram p5: LCD.SchDoc]

### Parts
C79  0.1 µF  [CAP 0603_1608]
C80  1 µF  [CAP 0603_1608]
C81  0.1 µF  [CAP 0603_1608]
IC1  Taken From Chinese PCB  [DIODES SOT-23-3]  (value not drawn)
J4  52745-0897  [MOLX-52745-0897]
R42  1 kOhms  [RES 0603_1608]

### Ports
BACKLIGHT_EN, LCD_CS, LCD_DC, LCD_RST, LCD_SCL, LCD_SDA

### Nets
3V3_ESP: C79.2 C80.2 C81.2 IC1.3(VIN) J4.2
GND: C79.1 C80.1 C81.1 J4.7 J4.MP1 J4.MP2
LCD_BACK: IC1.2(VOUT) J4.8
NetIC1_1: IC1.1(GND) R42.1
NetJ4_1: J4.1 ; port LCD_CS
NetJ4_3: J4.3 ; port LCD_SCL
NetJ4_4: J4.4 ; port LCD_SDA
NetJ4_5: J4.5 ; port LCD_DC
NetJ4_6: J4.6 ; port LCD_RST
NetR42_2: R42.2 ; port BACKLIGHT_EN

### Notes on the sheet
- (in symbol 52745-0897) ER-TFT2.25-1; 2.25”TFT LCD 76x284 Pixels Display Panel

### Library data of the parts
C79 C81 = C0603C104M5RACTU: as C82 on sheet IOs; Part Number: C0603C104M5RACTU; value: 0.1 µF; Applications: Bypass, Decoupling; Capacitance: 0.1 µF; componentlink1description: Datasheet; componentlink1url: https://api.kemet.com/component-edge/download/datasheet/C0603C104M5RACTU.pdf; componentlink2description: DigiKey Link; componentlink2url: https://www.digikey.com/en/products/detail/kemet/C0603C104M5RACTU/2199782; Device Package: 0603 (1608 Metric); lastupdated: 06/04/2026 19:22:47; Lifecycle Status: Active; Minimum Order: 1; Mounting Type: Surface Mount, MLCC; Operating Temperature: -55°C ~ 125°C; Package / Case: 0603 (1608 Metric); packaging: CutTape; partid: 69106; Part Status: Active; price: 0.01; series: SMD Comm X7R; Size / Dimension: 0.063" L x 0.031" W (1.60mm x 0.80mm); Supplier 1: DigiKey; Supplier Part Number 1: 399-C0603C104M5RACTUCT-ND; Thickness (Max): 0.034" (0.87mm)
C80 = GMC10X7R105M50NT: as C83 on sheet ESP32P4; Part Number: GMC10X7R105M50NT; Applications: General Purpose; Capacitance: 1 µF; componentlink1description: Datasheet; componentlink1url: https://calchip.com/wp-content/uploads/2024/02/gmc_series-1.pdf; componentlink2description: DigiKey Link; componentlink2url: https://www.digikey.com/en/products/detail/cal-chip-electronics-inc/GMC10X7R105M50NT/25323876; Device Package: 0603 (1608 Metric); lastupdated: 06/04/2026 19:17:52; Lifecycle Status: Active; Minimum Order: 1; Mounting Type: Surface Mount, MLCC; Operating Temperature: -55°C ~ 125°C; Package / Case: 0603 (1608 Metric); packaging: TapeAndReel; partid: 65934; price: 0.06; series: GMC; Size / Dimension: 0.063" L x 0.031" W (1.60mm x 0.80mm); Supplier 1: DigiKey; Supplier Part Number 1: 4713-GMC10X7R105M50NTCT-ND; Thickness (Max): 0.037" (0.95mm); value: 1 µF
IC1 = AP7313-15SRG-7: IC REG LINEAR LED DRIVER 60mA; Manufacturer: Diodes Incorporated; Current - Quiescent (Iq): 75 µA; Current - Supply (Max): 85 µA; Number of Regulators: 1; Output Configuration: Positive; Output Type: Fixed; Protection Features: Over Current, Over Temperature, Short Circuit; PSRR: 65dB (100Hz); Voltage - Input (Max): 6V; Voltage - Output (Min/Fixed): 1.5V; Part Number: Taken From Chinese PCB; ComponentLink1Description: Datasheet; ComponentLink1URL: https://www.diodes.com/assets/Datasheets/AP7313.pdf; ComponentLink2Description: DigiKey Link; ComponentLink2URL: https://www.digikey.com/en/products/detail/diodes-incorporated/AP7313-15SRG-7/4249709; Current - Output: 60mA; LastUpdated: 05/04/2026 20:53:04; Lifecycle Status: Active; Minimum Order: 1; Mounting Type: Surface Mount; Operating Temperature: -40°C ~ 85°C; Packaging: TapeAndReel; Price: 0.09; Series: -; Supplier 1: DigiKey; Supplier Part Number 1: 31-AP7313-15SRG-7CT-ND; Supplier Device Package: SOT23R
J4 = 52745-0897: 0.5 mm Pitch Easy-On(TM) Type FPC Connector, 2.0 mm Mated Height, Right Angle, ZIF, SMT, Top Contact, 8 Circuits, -20 to 85 degC, ELV and RoHS Compliant, Tape and Reel; Manufacturer: Molex; Material - Plating Mating: Gold; Stackable: No; Material - Metal: Phosphor Bronze; PCB Retention: Yes; Mated Height: 2.00mm; Durability (mating cycles max): 20; Circuits (Loaded): 8; Current (Max per Contact): 0.5A; Pitch - Mating Interface: 0.50mm; Voltage (Max): 50V; Entry Angle: 90degrees Angle; Mounting Technology: Surface Mount; Packing: Tape and Reel; ComponentLink3URL: http://www.molex.com/pdm_docs/sd/527450897_sd.pdf; ComponentLink2URL: http://www.molex.com/webdocs/datasheets/pdf/en-us/0527450897_FFC_FPC_CONNECTORS.pdf; PackageVersion: Rev. C, 07/2010; PackageReference: 52745-0897; Contact Position: Top; Orientation: Right Angle; ComponentLink1Description: Manufacturer URL; ComponentLink2Description: Datasheet; Material - Plating Termination: Gold; PartNumber: 52745-0897; Number of Rows: 1; PackageDescription: 8-Lead FPC Connector, Pitch 0.5 mm; ComponentLink3Description: Package Specification; ComponentLink1URL: http://www.molex.com/molex/index.jsp; Polarized to PCB: Yes; PCB Locator: No; RoHS: TRUE
R42 = ERJ-PA3F1001V: as R73 on sheet IOs; ComponentLink1Description: Datasheet; ComponentLink1URL: https://industrial.panasonic.com/cdbs/www-data/pdf/RDO0000/AOA0000C331.pdf; ComponentLink2Description: DigiKey Link; ComponentLink2URL: https://www.digikey.com/en/products/detail/panasonic-electronic-components/ERJ-PA3F1001V/5035848; Composition: Thick Film; Device Package: 0603 (1608 Metric); Features: Automotive AEC-Q200 Pulse Withstanding; Height - Seated (Max): 0.022\ (0.55mm); LastUpdated: 2024-02-09 20:42:57.220000; Lifecycle Status: Active; Part Number: ERJ-PA3F1001V; Minimum Order: 1; Number of Terminations: 2; Operating Temperature: -55°C ~ 155°C; Package / Case: 0603 (1608 Metric); Packaging: TapeAndReel; PartId: 14885; Part Status: Active; Price: 0.01; Ratings: AEC-Q200; Resistance: 1 kOhms; Series: ERJ-PA3; Size / Dimension: 0.063\ L x 0.031\ W (1.60mm x 0.80mm); Supplier 1: DigiKey; Supplier Part Number 1: P1.0KBYCT-ND; Supplier Device Package: 0603; Tolerance: ±1%; Value: 1 kOhms

## Nets that join several sheets
3V3: DAQ (14 pins), Power (C6.2 C62.2 R7.2 U3.1)
3V3_ESP: Power (7 pins), ESP32P4 (16 pins), LCD (5 pins)
5V3_BUCK: DAQ (33 pins), Power (12 pins)
5V_BUCK: Power (5 pins), IOs (14 pins)
15V_LDO: DAQ (8 pins), Power (C45.2 R17.2 U6.1)
20V_USB: Power (7 pins), IOs (J2.5)
24V_LDO: DAQ (10 pins), Power (C92.2 R52.1 U29.1)
+15V_ANA: DAQ (C25.2 U24.11), IOs (J2.1)
-15V_ANA: DAQ (C31.2 U24.1 U24.17), IOs (J2.3)
-15V_LDO: DAQ (8 pins), Power (C49.2 C50.1 R39.1 U7.1)
-24V_LDO: DAQ (U23.B1 U23.B2 U23.B3 U23.B4), Power (C96.2 C97.1 R77.1 U31.1)
GND: DAQ (147 pins), Power (181 pins), IOs (31 pins), ESP32P4 (30 pins), LCD (6 pins)
V_DUT: DAQ (8 pins), Power (C70.2 FB12.2)
NetJ3_2: DAQ (U25.3), IOs (J3.2)
NetJ4_1: ESP32P4 (U30.14), LCD (J4.1)
NetJ4_3: ESP32P4 (U30.13), LCD (J4.3)
NetJ4_4: ESP32P4 (U30.12), LCD (J4.4)
NetJ4_5: ESP32P4 (U30.11), LCD (J4.5)
NetJ4_6: ESP32P4 (U30.8), LCD (J4.6)
NetJ5_1: IOs (J5.1), ESP32P4 (R67.2 U30.21)
NetJ5_5: IOs (J5.5), ESP32P4 (U30.54)
NetJ5_7: IOs (J5.7), ESP32P4 (U30.55)
NetR2_2: Power (U6.4 U7.3 U29.4 U31.3), ESP32P4 (R2.2 U30.18)
NetR3_2: Power (U27.L4), ESP32P4 (R3.2 U30.19)
NetR5_2: DAQ (R5.2 R26.1), ESP32P4 (U30.64)
NetR6_2: DAQ (R6.2 R29.1), ESP32P4 (U30.65)
NetR20_1: Power (U3.4), ESP32P4 (R20.1 U30.70)
NetR25_2: DAQ (5 pins), ESP32P4 (U30.80)
NetR28_2: DAQ (5 pins), ESP32P4 (U30.81)
NetR41_1: Power (U5.7 U5.9), ESP32P4 (R41.1 U30.82)
NetR42_2: ESP32P4 (U30.7), LCD (R42.2)
NetR51_1: DAQ (U20.2), Power (U3.5), ESP32P4 (R51.1 U30.69)
NetR68_1: DAQ (U2.5), Power (U26.1 U28.5), ESP32P4 (R68.1 U30.67)
NetR69_1: DAQ (U2.4), Power (U26.2 U28.4), ESP32P4 (R69.1 U30.68)
NetR73_2: IOs (R73.2), ESP32P4 (U30.6)
NetU1_C9: DAQ (U1.C9 U22.C9 U23.C9), ESP32P4 (U30.17)
NetU1_E10: DAQ (U1.E10), ESP32P4 (U30.30)
NetU1_E11: DAQ (U1.E11), ESP32P4 (U30.29)
NetU1_E12: DAQ (U1.E12), ESP32P4 (U30.28)
NetU1_E13: DAQ (U1.E13), ESP32P4 (U30.27)
NetU1_E14: DAQ (U1.E14), ESP32P4 (U30.26)
NetU22_E10: DAQ (U22.E10 U23.E10), ESP32P4 (U30.25)
NetU22_E11: DAQ (U22.E11 U23.E11), ESP32P4 (U30.24)
NetU22_E12: DAQ (U22.E12 U23.E12), ESP32P4 (U30.23)
NetU22_E13: DAQ (U22.E13), ESP32P4 (U30.22)
NetU22_E14: DAQ (U22.E14), ESP32P4 (U30.20)
NetU23_E13: DAQ (U23.E13), ESP32P4 (U30.57)
NetU23_E14: DAQ (U23.E14), ESP32P4 (U30.56)
NetU24_14: DAQ (U24.14), ESP32P4 (U30.79)
NetU24_15: DAQ (U24.15), ESP32P4 (U30.78)
NetU24_16: DAQ (U24.16 U25.16), ESP32P4 (U30.77)
NetU25_14: DAQ (U25.14), ESP32P4 (U30.75)
NetU25_15: DAQ (U25.15), ESP32P4 (U30.76)
NetU27_L2: Power (U27.L2), ESP32P4 (U30.32)
NetU27_L3: Power (U27.L3), ESP32P4 (U30.31)
USB_FS_N: IOs (J1.A7 J1.B7), ESP32P4 (U30.50)
USB_FS_P: IOs (J1.A6 J1.B6), ESP32P4 (U30.51)
USB_HS_N: IOs (J5.4), ESP32P4 (U30.48)
USB_HS_P: IOs (J5.2), ESP32P4 (U30.49)